# EasyEDA Pro project ProPrj_ESP32C3CameraTrigger 2026-09-02_2026-09-03.epro

# Schematic ESP32CamTrigger
Board Name: ESP32CamTrigger_1; Create Date: 2025-09-15; Page Name: ESP32CamTrigger_sch; Project Name: ESP32C3CameraTrigger 2025-09-15; Schematic Name: ESP32CamTrigger_1; Update Date: 2025-09-15; Company: www.jeefun.cc; Drawn: yiming@jeefun.cc; Page Size: A3; Part Number: JFPCB-2507-002; Reviewed: yiming@jeefun.cc; Version: V0.1
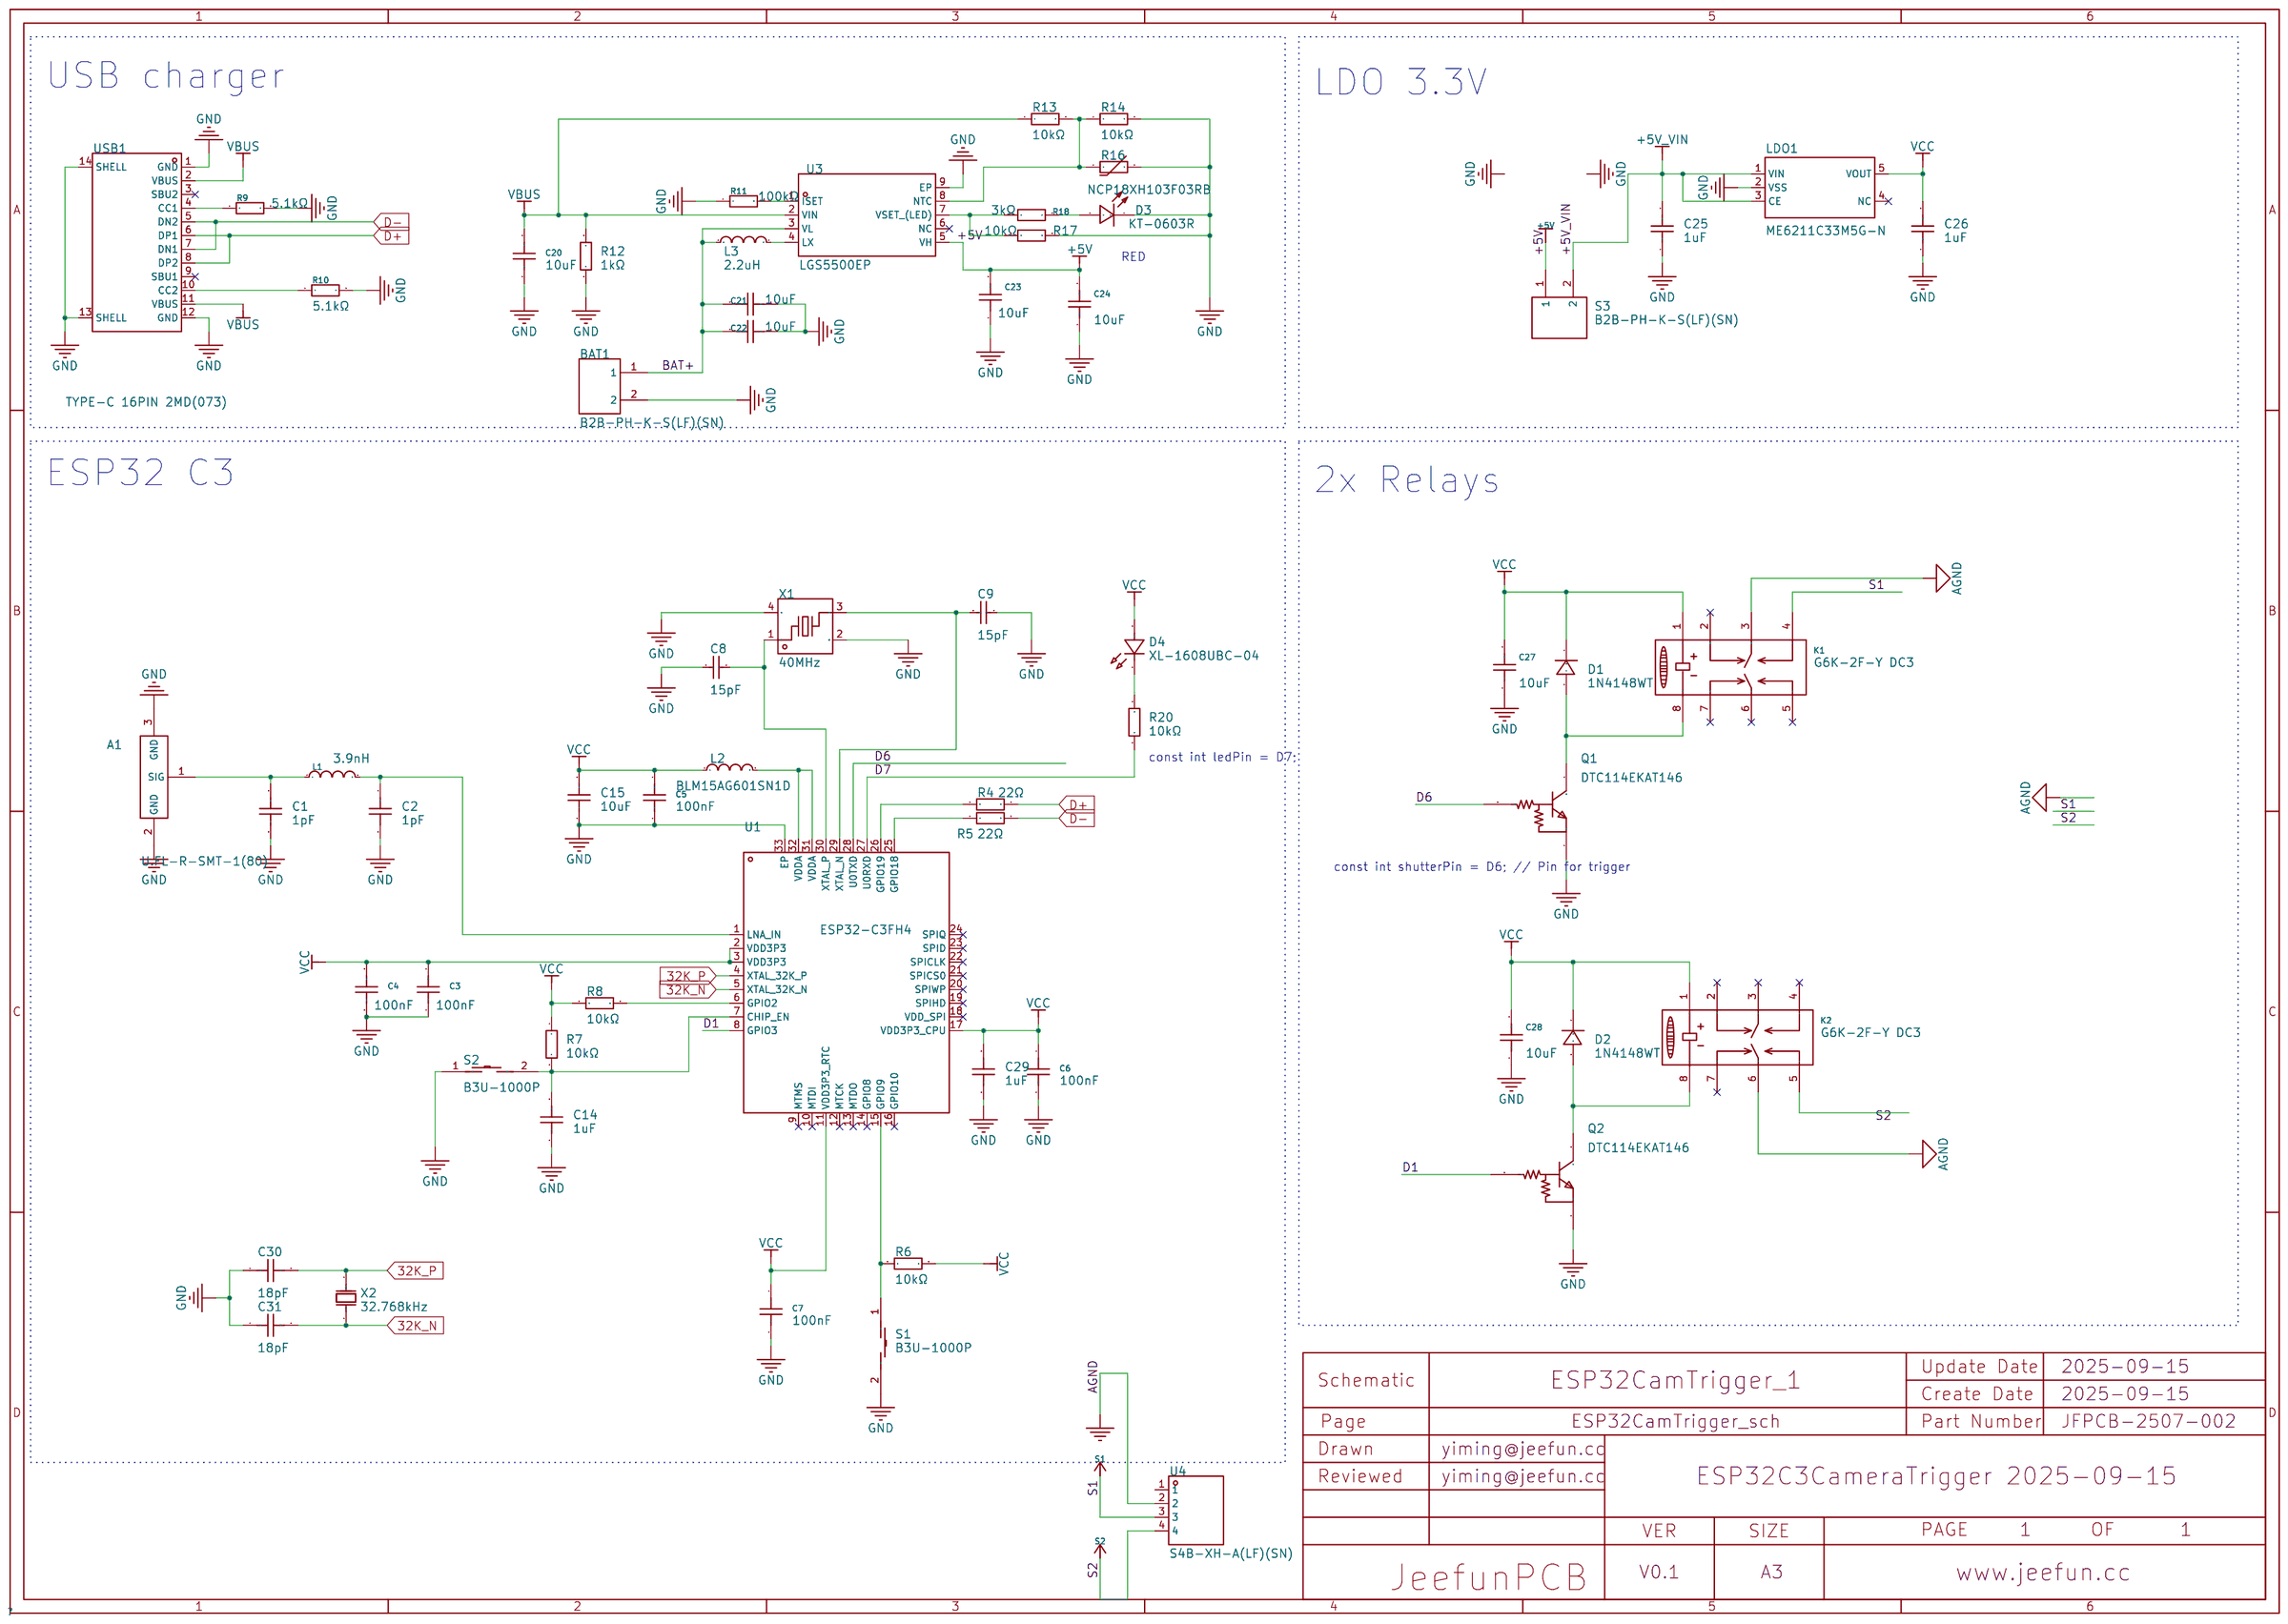
[diagram p0: schematic sheet]

## Parts
A1  U.FL-R-SMT-1(80)  [RF-SMD_FRF05002-JSS103M]
BAT1  B2B-PH-K-S(LF)(SN)  [CONN-TH_B2B-PH-K-S]
C1  1pF  [C0402]
C2  1pF  [C0402]
C3  100nF  [C0402]
C4  100nF  [C0402]
C5  100nF  [C0402]
C6  100nF  [C0402]
C7  100nF  [C0402]
C8  15pF  [C0402]
C9  15pF  [C0402]
C14  1uF  [C0603]
C15  10uF  [C0603]
C20  10uF  [C0603]
C21  10uF  [C0603]
C22  10uF  [C0603]
C23  10uF  [C0603]
C24  10uF  [C0603]
C25  1uF  [C0603]
C26  1uF  [C0603]
C27  10uF  [C0603]
C28  10uF  [C0603]
C29  1uF  [C0603]
C30  18pF  [C0402]
C31  18pF  [C0402]
D1  1N4148WT  [SOD-523_L1.2-W0.8-LS1.6-RD]
D2  1N4148WT  [SOD-523_L1.2-W0.8-LS1.6-RD]
D3  KT-0603R  [LED0603-RD]
D4  XL-1608UBC-04  [LED0603-RD_BLUE]
K1  G6K-2F-Y DC3  [RELAY-SMD_G6K-2F-Y]
K2  G6K-2F-Y DC3  [RELAY-SMD_G6K-2F-Y]
L1  3.9nH  [L0402]
L2  BLM15AG601SN1D  [L0402]
L3  2.2uH  [IND-SMD_L7.1-W6.5-P5.60]
LDO1  ME6211C33M5G-N  [SOT-23-5_L3.0-W1.7-P0.95-LS2.8-BL]
Q1  DTC114EKAT146  [SOT-346_L2.9-W1.6-P1.90-LS2.8-TR-CW]
Q2  DTC114EKAT146  [SOT-346_L2.9-W1.6-P1.90-LS2.8-TR-CW]
R4  22Ω  [R0402]
R5  22Ω  [R0402]
R6  10kΩ  [R0402]
R7  10kΩ  [R0402]
R8  10kΩ  [R0402]
R9  5.1kΩ  [R0402]
R10  5.1kΩ  [R0402]
R11  100kΩ  [R0402]
R12  1kΩ  [R0603]
R13  10kΩ  [R0402]
R14  10kΩ  [R0402]
R16  NCP18XH103F03RB  [R0603]
R17  10kΩ  [R0402]
R18  3kΩ  [R0402]
R20  10kΩ  [R0402]
S1  B3U-1000P  [KEY-SMD_B3U-1000PM]
S2  B3U-1000P  [KEY-SMD_B3U-1000PM]
S3  B2B-PH-K-S(LF)(SN)  [CONN-TH_B2B-PH-K-S]
U1  ESP32-C3FH4  [QFN-32_L5.0-W5.0-P0.50-BL-EP3.7]
U3  LGS5500EP  [ESOP-8_L4.9-W3.9-P1.27-LS6.0-TL-EP3.3]
U4  S4B-XH-A(LF)(SN)  [CONN-TH_S4B-XH-A-LF-SN]
USB1  TYPE-C 16PIN 2MD(073)  [USB-C-SMD_TYPE-C-6PIN-2MD-073]
X1  40MHz  [CRYSTAL-SMD_4P-L2.0-W1.6-BL-2]
X2  32.768kHz  [CRYSTAL-SMD_L3.2-W1.5-1]

## Library data of the parts
A1 = U.FL-R-SMT-1(80)_C88374: Connector Type:板端 Interface Type:内针 Number of Ports:1 Interface Diameter:2mm Interface Length/Height:1.25mm Frequency-Max:6GHz RF Series:IPEX Impedance:50Ω Style:- Contact Material:Brass Operating Temperature Range:-40℃~+90℃ Operating Temperature Range:-4; LCSC Part Name: IPEX 内针; Supplier Part: C88374; Manufacturer: HRS(广濑); Supplier Footprint: SMD; JLCPCB Part Class: Extended Part; Datasheet: https://atta.szlcsc.com/upload/public/pdf/source/20161125/1480067868647.pdf; Supplier: LCSC; Connector Type: 板端; Interface Type: 内针; Number of Ports: 1; Interface Diameter: 2mm; Interface Length/Height: 1.25mm; Frequency-Max: 6GHz; RF Series: IPEX; Impedance: 50Ω; Contact Material: Brass; Operating Temperature Range: -40℃~+90℃
BAT1 S3 = B2B-PH-K-S(LF)(SN): Pins Structure:1x2P Pitch:2mm Mounting Type:Direct Insert Reference Series:PH Number of Pins:2P Number of Rows:1 Number of PINs Per Row:2 Row Spacing:- Current Rating:2A Contact Material:Brass Contact Plating:Tin Operating Temperature:-25℃~+85℃ Operating; LCSC Part Name: 1x2P 间距:2mm 直插 系列:PH; Supplier Part: C131337; Manufacturer: JST; Supplier Footprint: 插件,P=2mm; JLCPCB Part Class: Extended Part; Datasheet: https://atta.szlcsc.com/upload/public/pdf/source/20171026/C131342_15089839687311058815.pdf; Supplier: LCSC; Pins Structure: 1x2P; Pitch: 2mm; Mounting Type: Direct Insert; Reference Series: PH; Number of Pins: 2P; Number of Rows: 1; Number of PINs Per Row: 2; Current Rating: 2A; Contact Material: Brass; Contact Plating: Tin; Operating Temperature: -25℃~+85℃; Voltage Rating: 100V; Plastic Material: PA66; Flame Retardant Rating: UL94V-0; Supplementary Features: K-leg punch; Color: White; Z-Height of the Board: 6mm; X-Length of Bottom Edge on Board (Spacing Line): 5.9mm; Y-Width of Bottom Edge on Board: 4.5mm
C1 C2 = CC0402CRNPO9BN1R0: Capacitance: Voltage Rated: Temperature Coefficient:; LCSC Part Name: 1pF 50V; Supplier Part: C277493; Manufacturer: YAGEO(国巨); Supplier Footprint: 0402; JLCPCB Part Class: Extended Part; Datasheet: https://atta.szlcsc.com/upload/public/pdf/source/20181008/C309499_21CC21451B82C39E3D92150FD6B30293.pdf; Supplier: LCSC
C3-C7 = GRM155R71H104KE14D: Capacitance: Tolerance:±10% Tolerance:±10% Voltage Rated: Temperature Coefficient:; LCSC Part Name: 100nF ±10% 50V; Supplier Part: C77020; Manufacturer: muRata(村田); Supplier Footprint: 0402; JLCPCB Part Class: Extended Part; Datasheet: https://atta.szlcsc.com/upload/public/pdf/source/20180326/C77020_39BD49C951FF1AF0DB1F1FAC5AC1E401.pdf; Supplier: LCSC; Tolerance: ±10%
C8 C9 = GJM1555C1H150FB01D: Capacitance: Tolerance:±1% Tolerance:±1% Voltage Rated: Temperature Coefficient:; LCSC Part Name: 15pF ±1% 50V; Supplier Part: C441742; Manufacturer: muRata(村田); Supplier Footprint: 0402; Datasheet: https://atta.szlcsc.com/upload/public/pdf/source/20200305/C490387_23319AE8C154DEB24C505E6C82A8106A.pdf; Supplier: LCSC; Tolerance: ±1%
C14 C25 C26 C29 = CGA0603X5R105K500JT: 容值:1uF;精度:±10%;额定电压:50V;温度系数:X5R;; LCSC Part Name: 1uF ±10% 50V; Supplier Part: C6119852; Manufacturer: HRE(芯声); Supplier Footprint: 0603; JLCPCB Part Class: 扩展库; Supplier: LCSC; Tolerance: ±10%; Voltage Rating: 50V; Temperature Coefficient: X5R
C15 C20-C24 C27 C28 = CL10A106MA8NRNC: Capacitance:10uF Tolerance:±20% Tolerance:±20% Voltage Rating:25V Temperature Coefficient:X5R; LCSC Part Name: 10uF ±20% 25V; Supplier Part: C96446; Manufacturer: SAMSUNG(三星); Supplier Footprint: 0603; JLCPCB Part Class: Basic Part; Datasheet: https://item.szlcsc.com/datasheet/CL10A106MA8NRNC/97651.html; Supplier: LCSC; Tolerance: ±20%; Voltage Rating: 25V; Temperature Coefficient: X5R
C30 C31 = GRM1555C1H180FA01D: Capacitance: Tolerance:±1% Tolerance:±1% Voltage Rated: Temperature Coefficient:; LCSC Part Name: 18pF ±1% 50V; Supplier Part: C161534; Manufacturer: muRata(村田); Supplier Footprint: 0402; JLCPCB Part Class: Extended Part; Datasheet: https://atta.szlcsc.com/upload/public/pdf/source/20180308/C161534_15204897149751413943.pdf; Supplier: LCSC; Tolerance: ±1%
D1 D2 = 1N4148WT_C232841: Diode Configuration:Independent Voltage - Forward(Vf@If):1V@10mA Voltage - DC Reverse(Vr):75V Current - Rectified:300mA Pd - Power Dissipation:200mW Reverse Leakage Current (Ir):5uA@75V Reverse Recovery Time (trr):4ns Operating Junction Temperature Range:; Supplier Part: C232841; Manufacturer: onsemi(安森美); Supplier Footprint: SOD-523F; JLCPCB Part Class: Extended Part; Datasheet: https://item.szlcsc.com/datasheet/1N4148WT/232639.html; Supplier: LCSC; Diode Configuration: Independent; Voltage - Forward(Vf@If): 1V@10mA; Voltage - DC Reverse(Vr): 75V; Current - Rectified: 300mA; Pd - Power Dissipation: 200mW; Reverse Leakage Current (Ir): 5uA@75V; Reverse Recovery Time (trr): 4ns; Operating Junction Temperature Range: -55℃~+150℃@(Tj)
D3 = KT-0603R: Emitted Color:Red Power Dissipation:- Forward Current:- Dominant Wavelength:- Dominant Wavelength:- Peak Wavelength:- Diode Configuration:- Lens Color:- Color Temperature:- Color Temperature:- Viewing Angle:- Mounting Sytle:- Operating Temperature:-40℃~+8; LCSC Part Name: 0603 红灯 高亮; Supplier Part: C2286; Manufacturer: KENTO; Supplier Footprint: 0603; JLCPCB Part Class: Basic Part; Datasheet: https://atta.szlcsc.com/upload/public/pdf/source/20160616/1466072038404.pdf; Supplier: LCSC; Emitted Color: Red; Operating Temperature: -40℃~+85℃
D4 = XL-1608UBC-04: Lamp Holder Type:- Illumination Color:Blue Voltage - Forward(Vf):3.3V Voltage - Forward(Vf):3.3V Power(Watts):70mW Forward Current:20mA Wavelength - Dominant:455nm~475nm Wavelength - Dominant:455nm~475nm Peak Wavelength:470nm Diode Configuration:- Lens Co; Supplier Part: C965807; Manufacturer: XINGLIGHT(成兴光); Supplier Footprint: 0603; JLCPCB Part Class: Extended Part; Datasheet: https://item.szlcsc.com/datasheet/XL-1608UBC-04/1051416.html; Supplier: LCSC; Illumination Color: Blue; Voltage - Forward(Vf): 3.3V; Power(Watts): 70mW; Forward Current: 20mA; Wavelength - Dominant: 455nm~475nm; Peak Wavelength: 470nm; Lens Color: Water Clear; Luminous Intensity: 300mcd; Viewing Angle: 120°; Mounting Style: op View Mount
K1 K2 = G6K-2F-Y DC3: Coil Voltage:- Contact Form:- Pin Number:- Contact Rating:- Maximum Switching Voltage:- Contact Material:- Coil Resistance:- Maximum Switching Current:- Operate Time:- Release Time:- Coil Type:- Contact Resistance:- Operating Temperature:- Operating Tempe; LCSC Part Name: G6K-2F-Y 3VDC; Supplier Part: C93168; Manufacturer: OMRON(欧姆龙); Supplier Footprint: SMD,6.5x10mm; JLCPCB Part Class: Extended Part; Datasheet: https://atta.szlcsc.com/upload/public/pdf/source/20220125/C1876770_53E5491D4B68F29C4BBD8118E9BAE0E8.pdf; Supplier: LCSC
L1 = LQG15HS3N9S02D: Inductance: Tolerance:- Tolerance:- Rated Current: Saturation Current (Isat):- DC Resistance (DCR): Q @ Freq:8@100MHz Frequency - Self Resonant: Ratings:; Supplier Part: C77109; Manufacturer: muRata(村田); Supplier Footprint: 0402; Datasheet: https://atta.szlcsc.com/upload/public/pdf/source/20180612/C185484_14F678484DDF036353DC67B6265A9221.pdf; Supplier: LCSC; Q @ Freq: 8@100MHz
L2 = BLM15AG601SN1D: Impedance @ Frequency:600Ω@100MHz Tolerance:±25% Tolerance:±25% DC Resistance:520mΩ Current Rating:300mA Circuits:1; LCSC Part Name: 单路 0402磁珠 阻抗600Ω@100MHz; Supplier Part: C76884; Manufacturer: muRata(村田); Supplier Footprint: 0402; JLCPCB Part Class: Extended Part; Datasheet: https://atta.szlcsc.com/upload/public/pdf/source/20181120/C333978_3E581FB55966932B05020139ABDE8E01.pdf; Supplier: LCSC; Impedance @ Frequency: 600Ω@100MHz; Tolerance: ±25%; DC Resistance: 520mΩ; Current Rating: 300mA; Circuits: 1
L3 = SPM6530T-2R2M: Inductance: Tolerance:±20% Tolerance:±20% Rated Current: Saturation Current (Isat):8.4A DC Resistance (DCR): Type:- Ratings:-; LCSC Part Name: 2.2uH ±20% 8.4A; Supplier Part: C76855; Manufacturer: TDK; Supplier Footprint: SMD,7.1x6.5mm; JLCPCB Part Class: Extended Part; Datasheet: https://atta.szlcsc.com/upload/public/pdf/source/20160918/1474166942087.pdf; Supplier: LCSC; Tolerance: ±20%; Saturation Current (Isat): 8.4A
LDO1 = ME6211C33M5G-N: Output Type:Fixed Voltage - Supply:6V Output Voltage:3.3V Output Voltage:3.3V Output Current:500mA Power Supply Rejection Ratio (PSRR):70dB@(1kHz) Voltage Dropout:120mV@(100mA) standby current:60uA Noise:50uVrms Features:Over Current Protection；Enable；Sho; LCSC Part Name: 输入6V 输出3.3V 500mA; Supplier Part: C82942; Manufacturer: MICRONE(南京微盟); Supplier Footprint: SOT-23-5; JLCPCB Part Class: Extended Part; Datasheet: https://atta.szlcsc.com/upload/public/pdf/source/20170918/C82942_1505727073070976520.pdf; Supplier: LCSC; Output Type: Fixed; Voltage - Supply: 6V; Output Voltage: 3.3V; Output Current: 500mA; Power Supply Rejection Ratio (PSRR): 70dB@(1kHz); Voltage Dropout: 120mV@(100mA); standby current: 60uA; Noise: 50uVrms; Features: Over Current Protection；Enable；Short Circuit Protection; Operating Temperature: -40℃~+150℃; Output Configuration: Positive; Number of Outputs: 1
Q1 Q2 = DTC114EKAT146: Transistor Type:- Collector-Emitter Breakdown Voltage (Vceo):50V Collector Current (Ic):50mA Power Dissipation (Pd):200mW DC Current Gain (hFE@Ic,Vce):30@5mA,5V; LCSC Part Name: 耐压:50V 电流:50mA; Supplier Part: C79971; Manufacturer: ROHM(罗姆); Supplier Footprint: TO-236-3(SOT-23-3); JLCPCB Part Class: Extended Part; Datasheet: https://atta.szlcsc.com/upload/public/pdf/source/20170818/C79971_1503051322827895391.pdf; Supplier: LCSC; Collector-Emitter Breakdown Voltage (Vceo): 50V; Collector Current (Ic): 50mA; Power Dissipation (Pd): 200mW; DC Current Gain (hFE@Ic,Vce): 30@5mA,5V
R4 R5 = RC0402JR-0722RL: Type:Thick Film Resistors Resistance: Tolerance:±5% Tolerance:±5% Power(Watts): Overload Voltage (Max): Temperature Coefficient:±100ppm/℃ Temperature Coefficient:±100ppm/℃ Operating Temperature Range:-55℃~+155℃ Operating Temperature Range:-55℃~+155℃; LCSC Part Name: 厚膜电阻 22Ω ±5% 62.5mW; Supplier Part: C93929; Manufacturer: YAGEO(国巨); Supplier Footprint: 0402; JLCPCB Part Class: Extended Part; Datasheet: https://atta.szlcsc.com/upload/public/pdf/source/20180821/C275644_0D56F95EFF785E7D9A1FEF436B37DA78.pdf; Supplier: LCSC; Type: Thick Film Resistors; Tolerance: ±5%; Temperature Coefficient: ±100ppm/℃; Operating Temperature Range: -55℃~+155℃
R6-R8 R13 R14 R17 R20 = RC0402FR-0710KL: Type:Thick Film Resistors Resistance: Tolerance:±1% Tolerance:±1% Power(Watts): Overload Voltage (Max): Temperature Coefficient:±100ppm/℃ Temperature Coefficient:±100ppm/℃ Operating Temperature Range:-55℃~+155℃ Operating Temperature Range:-55℃~+155℃; LCSC Part Name: 厚膜电阻 10kΩ ±1% 62.5mW; Supplier Part: C60490; Manufacturer: YAGEO(国巨); Supplier Footprint: 0402; Datasheet: https://atta.szlcsc.com/upload/public/pdf/source/20170925/C131467_1506321478108990263.pdf; Supplier: LCSC; Type: Thick Film Resistors; Tolerance: ±1%; Temperature Coefficient: ±100ppm/℃; Operating Temperature Range: -55℃~+155℃
R9 R10 = 0402WGF5101TCE: Type:Thick Film Resistor Resistance:5.1kΩ Tolerance:±1% Tolerance:±1% Power(Watts):62.5mW Voltage-Supply(Max):50V Temperature Coefficient:±100ppm/℃ Temperature Coefficient:±100ppm/℃ Operating Temperature:-55℃~+155℃ Operating Temperature:-55℃~+155℃; LCSC Part Name: 5.1kΩ ±1% 62.5mW 厚膜电阻; Supplier Part: C25905; Manufacturer: UNI-ROYAL(厚声); Supplier Footprint: 0402; JLCPCB Part Class: 基础库; Datasheet: https://item.szlcsc.com/datasheet/0402WGF5101TCE/26648.html; Supplier: LCSC; Type: Thick Film Resistor; Tolerance: ±1%; Power(Watts): 62.5mW; Voltage-Supply(Max): 50V; Temperature Coefficient: ±100ppm/℃; Operating Temperature: -55℃~+155℃
R11 = 0402WGF1003TCE: Type:Thick Film Resistor Resistance:100kΩ Tolerance:±1% Tolerance:±1% Power(Watts):62.5mW Voltage-Supply(Max):50V Temperature Coefficient:±100ppm/℃ Temperature Coefficient:±100ppm/℃ Operating Temperature:-55℃~+155℃ Operating Temperature:-55℃~+155℃; LCSC Part Name: 100kΩ ±1% 62.5mW 厚膜电阻; Supplier Part: C25741; Manufacturer: UNI-ROYAL(厚声); Supplier Footprint: 0402; JLCPCB Part Class: 基础库; Datasheet: https://item.szlcsc.com/datasheet/0402WGF1003TCE/26484.html; Supplier: LCSC; Type: Thick Film Resistor; Tolerance: ±1%; Power(Watts): 62.5mW; Voltage-Supply(Max): 50V; Temperature Coefficient: ±100ppm/℃; Operating Temperature: -55℃~+155℃
R12 = 0603WAJ0102T5E: Type:Thick Film Resistor Resistance:1kΩ Tolerance:±5% Tolerance:±5% Power(Watts):100mW Voltage-Supply(Max):75V Temperature Coefficient:±100ppm/℃ Temperature Coefficient:±100ppm/℃ Operating Temperature:-55℃~+155℃ Operating Temperature:-55℃~+155℃; LCSC Part Name: 1kΩ ±5% 100mW 厚膜电阻; Supplier Part: C25585; Manufacturer: UNI-ROYAL(厚声); Supplier Footprint: 0603; JLCPCB Part Class: 扩展库; Datasheet: https://item.szlcsc.com/datasheet/0603WAJ0102T5E/26328.html; Supplier: LCSC; Type: Thick Film Resistor; Tolerance: ±5%; Power(Watts): 100mW; Voltage-Supply(Max): 75V; Temperature Coefficient: ±100ppm/℃; Operating Temperature: -55℃~+155℃
R16 = NCP18XH103F03RB: Resistance @ 25℃:10kΩ B Constant (25℃/50℃):3380K B Constant (25℃/75℃):- B Constant (25℃/85℃):3434K B Constant (25℃/100℃):3455K Power(Watts):100mW B Constant Tolerance:±1% Steady State Current (Max):310uA Operating Temperature:-40℃~+125℃ Operating Temperat; Supplier Part: C13564; Manufacturer: muRata(村田); Supplier Footprint: 0603; JLCPCB Part Class: Extended Part; Datasheet: https://item.szlcsc.com/datasheet/NCP18XH103F03RB/14214.html; Supplier: LCSC; Resistance @ 25℃: 10kΩ; B Constant (25℃/50℃): 3380K; B Constant (25℃/85℃): 3434K; B Constant (25℃/100℃): 3455K; Power(Watts): 100mW; B Constant Tolerance: ±1%; Steady State Current (Max): 310uA; Operating Temperature: -40℃~+125℃
R18 = 0402WGF3001TCE: Type:Thick Film Resistors Resistance:3kΩ Tolerance:±1% Tolerance:±1% Power(Watts): Overload Voltage (Max): Temperature Coefficient:±100ppm/℃ Temperature Coefficient:±100ppm/℃ Operating Temperature Range:-55℃~+155℃ Operating Temperature Range:-55℃~+155℃; LCSC Part Name: 3kΩ ±1% 62.5mW 厚膜电阻; Supplier Part: C25784; Manufacturer: UNI-ROYAL(厚声); Supplier Footprint: 0402; JLCPCB Part Class: Extended Part; Datasheet: https://atta.szlcsc.com/upload/public/pdf/source/20200306/C422600_1E6D84923E4A46A82E41ADD87F860B5C.pdf; Supplier: LCSC; Type: Thick Film Resistors; Tolerance: ±1%; Temperature Coefficient: ±100ppm/℃; Operating Temperature Range: -55℃~+155℃
S1 S2 = B3U-1000P_C231329: Circuit:SPST Actuator Style:Round Button Operating Force:153gf Mounting Style:Standing paste Switch Length:3mm Switch Width:2.5mm Switch Height:1.6mm Contact Current:50mA Voltage Rating (DC):12V With Lamp:- Pin Style:SMDSplicing Mechanical Life:- Operatin; LCSC Part Name: 3*2.5*1.6mm 立贴 轻触开关; Supplier Part: C231329; Manufacturer: OMRON(欧姆龙); Supplier Footprint: SMD,2.5x3mm; JLCPCB Part Class: Extended Part; Supplier: LCSC; Circuit: SPST; Actuator Style: Round Button; Operating Force: 153gf; Mounting Style: Standing paste; Switch Length: 3mm; Switch Width: 2.5mm; Switch Height: 1.6mm; Contact Current: 50mA; Voltage Rating (DC): 12V; Pin Style: SMDSplicing; Operating Temperature: -25℃~+70℃
U1 = ESP32-C3FH4: Supplier Part: C2858491; Manufacturer: ESPRESSIF(乐鑫); Supplier Footprint: QFN-32-EP(5x5); JLCPCB Part Class: Extended Part; Datasheet: https://item.szlcsc.com/datasheet/ESP32-C3FH4/3060870.html; Supplier: LCSC
U3 = LGS5500EP: The Chip Type:Battery Charge and Discharge Management Supply Voltage:4.5V~5.5V Supply Voltage:4.5V~5.5V Maximum Charge Current:1A Charging Saturation Voltage:4.6V；4.35V；4.3V；4.2V End-Off Voltage:2.9V Type of Battery:Lithium-ion/Polymer Number of Cells:1 N; LCSC Part Name: 1A充电,0.3A同步升压放电,超低待机2uA+的TP5400,ETA9697; Supplier Part: C5280699; Manufacturer: Legend-Si(棱晶半导体); Supplier Footprint: ESOP-8; JLCPCB Part Class: Extended Part; Datasheet: https://atta.szlcsc.com/upload/public/pdf/source/20230407/FCD039C21EAAD2C20B987E5BAB1B60C9.pdf; Supplier: LCSC; The Chip Type: Battery Charge and Discharge Management; Supply Voltage: 4.5V~5.5V; Maximum Charge Current: 1A; Charging Saturation Voltage: 4.6V；4.35V；4.3V；4.2V; End-Off Voltage: 2.9V; Type of Battery: Lithium-ion/Polymer; Number of Cells: 1; Operating Temperature: -40℃~+125℃
U4 = S4B-XH-A(LF)(SN): Pins Structure:1x4P Pitch:2.5mm Mounting Type:Right Angle Reference Series:XH Number of Pins:4P Number of Rows:1 Number of PINs Per Row:4 Row Spacing:- Current Rating:3A Contact Material:Brass Contact Plating:Tin Operating Temperature:-25℃~+85℃ Operating; LCSC Part Name: 1x4P 间距:2.5mm 弯插 系列:XH; Supplier Part: C157925; Manufacturer: JST; Supplier Footprint: 弯插,P=2.5mm; JLCPCB Part Class: Extended Part; Datasheet: https://item.szlcsc.com/datasheet/S4B-XH-A(LF)(SN)/169273.html; Supplier: LCSC; Pins Structure: 1x4P; Pitch: 2.5mm; Mounting Type: Right Angle; Reference Series: XH; Number of Pins: 4P; Number of Rows: 1; Number of PINs Per Row: 4; Current Rating: 3A; Contact Material: Brass; Contact Plating: Tin; Operating Temperature: -25℃~+85℃; Voltage Rating: 250V; Plastic Material: PA66; Flame Retardant Rating: UL94V-0; Supplementary Features: K Pin; Color: White; Z-Height of the Board: 6.1mm; X-Length of Bottom Edge on Board (Spacing Line): 12.4mm; Y-Width of Bottom Edge on Board: 11.5mm
USB1 = TYPE-C 16PIN 2MD(073): Connector Type:Type-C Protocol Standard:USB 3.1 Gender:Female Mounting Type:Surface Mount, Right Angle Number of Contacts:16P Number of Ports:1 Current Rating-Power:3A Voltage Rating:5V Connect-Disconnect Life:5,000 Cycles Supplementary Features:- Center; LCSC Part Name: Type-C 母 卧贴; Supplier Part: C2765186; Manufacturer: SHOU HAN(首韩); Supplier Footprint: SMD; JLCPCB Part Class: Extended Part; Datasheet: https://item.szlcsc.com/datasheet/TYPE-C%252016PIN%25202MD(073)/2901843.html; Supplier: LCSC; Connector Type: Type-C; Protocol Standard: USB 3.1; Gender: Female; Mounting Type: Surface Mount, Right Angle; Number of Contacts: 16P; Number of Ports: 1; Current Rating-Power: 3A; Voltage Rating: 5V; Connect-Disconnect Life: 5,000 Cycles; Detection color: Black; Operating Temperature: -25℃~+85℃
X1 = T201640MFBDE2X: Frequency:40MHz Normal temperature Frequency Tolerance:±10ppm Normal temperature Frequency Tolerance:±10ppm Load Capacitance: Operating Temperature: Operating Temperature:; LCSC Part Name: 40MHz ±10ppm 12pF; Supplier Part: C20885029; Manufacturer: YJX(雅晶鑫); Supplier Footprint: SMD2016-4P; JLCPCB Part Class: 扩展库; Datasheet: https://atta.szlcsc.com/upload/public/pdf/source/20240301/69B1A2250A2F911AB14AAD6A982488C4.pdf; Supplier: LCSC; Normal temperature Frequency Tolerance: ±10ppm
X2 = XKXGI-SUA-32.768K: Type:Surface Mount Crystal Frequency:32.768kHz Normal temperature Frequency Tolerance:±20ppm Normal temperature Frequency Tolerance:±20ppm Load Capacitance:12.5pF Frequency Stability:±30ppm Frequency Stability:±30ppm Operating Temperature:-40℃~+85℃ Operat; LCSC Part Name: YST310S 32.768KHZ 2P 3215 12.5PF ±20PPM -40~85℃; Supplier Part: C5213671; Manufacturer: YXC(扬兴晶振); Supplier Footprint: SMD3215-2P; JLCPCB Part Class: Extended Part; Datasheet: https://item.szlcsc.com/datasheet/XKXGI-SUA-32.768K/5908943.html; Supplier: LCSC; Type: Surface Mount Crystal; Normal temperature Frequency Tolerance: ±20ppm; Load Capacitance: 12.5pF; Frequency Stability: ±30ppm; Operating Temperature: -40℃~+85℃

## Nets
+5V: C23.2 C24.2 S3.1 U3.5(VH)
+5V_VIN: C25.2 LDO1.1(VIN) LDO1.3(CE) S3.2
AGND: K1.3 K2.6 U4.2
GND: A1.2(GND) A1.3(GND) BAT1.2 C1.2 C2.2 C3.1 C4.1 C5.2 C6.2 C7.2 C8.1 C9.2 C14.1 C15.1 C20.1 C21.1 C22.1 C23.1 C24.1 C25.1 C26.1 C27.1 C28.1 C29.1 C30.1 C31.1 D3.1(K) LDO1.2(VSS) Q1.1(E) Q2.1(E) R9.2 R10.2 R11.1 R12.1 R14.2 R16.2 R17.2 S1.2 S2.1 U1.33(EP) U3.9(EP) USB1.1(GND) USB1.12(GND) USB1.13(SHELL) USB1.14(SHELL) X1.2(GND) X1.4(GND)
VBUS: C20.2 R12.2 R13.1 U3.2(VIN) USB1.2(VBUS) USB1.11(VBUS)
VCC: C3.2 C4.2 C5.1 C6.1 C7.1 C15.2 C26.2 C27.2 C28.2 C29.2 D1.1(C) D2.1(C) D4.2(A) K1.1 K2.1 L2.1 LDO1.5(VOUT) R6.2 R7.1 R8.1 U1.2(VDD3P3) U1.3(VDD3P3) U1.11(VDD3P3_RTC) U1.17(VDD3P3_CPU)
32K_N: C31.2 U1.5(XTAL_32K_N) X2.1(OSC1)
32K_P: C30.2 U1.4(XTAL_32K_P) X2.2(OSC2)
BAT+: BAT1.1 C21.2 C22.2 L3.1 U3.3(VL)
D1: Q2.2(B) U1.8(GPIO3)
D6: Q1.2(B) U1.28(U0TXD)
D7: R20.1 U1.27(U0RXD)
D+: R4.2 USB1.6(DP1) USB1.8(DP2)
D-: R5.2 USB1.5(DN2) USB1.7(DN1)
S1: K1.4 U4.3
S2: K2.5 U4.4
$1N506: A1.1(SIG) C1.1 L1.1
$1N541: C2.1 L1.2 U1.1(LNA_IN)
$1N1807: C8.2 U1.30(XTAL_P) X1.1
$1N1815: C9.1 U1.29(XTAL_N) X1.3
$1N6331: R4.1 U1.26(GPIO19)
$1N6375: R5.1 U1.25(GPIO18)
$1N6429: C14.2 R7.2 S2.2 U1.7(CHIP_EN)
$1N6490: R6.1 S1.1 U1.15(GPIO9)
$1N9298: R8.2 U1.6(GPIO2)
$1N9448: L2.2 U1.31(VDDA) U1.32(VDDA)
$1N12514: R9.1 USB1.4(CC1)
$1N12518: R10.1 USB1.10(CC2)
$1N12731: R11.2 U3.1(ISET)
$1N13266: R13.2 R14.1 R16.1 U3.8(NTC)
$1N13419: L3.2 U3.4(LX)
$1N13736: R17.1 R18.1 U3.7(VSET (LED))
$1N13763: D3.2(A) R18.2
$1N14938: D1.2(A) K1.8 Q1.3(C)
$1N15274: D2.2(A) K2.8 Q2.3(C)
$1N15885: D4.1(K) R20.2

Not connected (* = marked no-connect by the designer): K1 2* 5* 6* 7*; K2 2* 3* 4* 7*; LDO1 4(NC)*; U1 9(MTMS)* 10(MTDI)* 12(MTCK)* 13(MTDO)* 14(GPIO8)* 16(GPIO10)* 18(VDD_SPI)* 19(SPIHD)* 20(SPIWP)* 21(SPICS0)* 22(SPICLK)* 23(SPID)* 24(SPIQ)*; U3 6(NC)*; U4 1; USB1 3(SBU2)* 9(SBU1)*

## Notes on the sheet
- USB charger
- LDO 3.3V
- RED
- ESP32 C3
- 2x Relays
- const int ledPin = D7;
- const int shutterPin = D6; // Pin for trigger

# Board ESP32CamTrigger_PCB
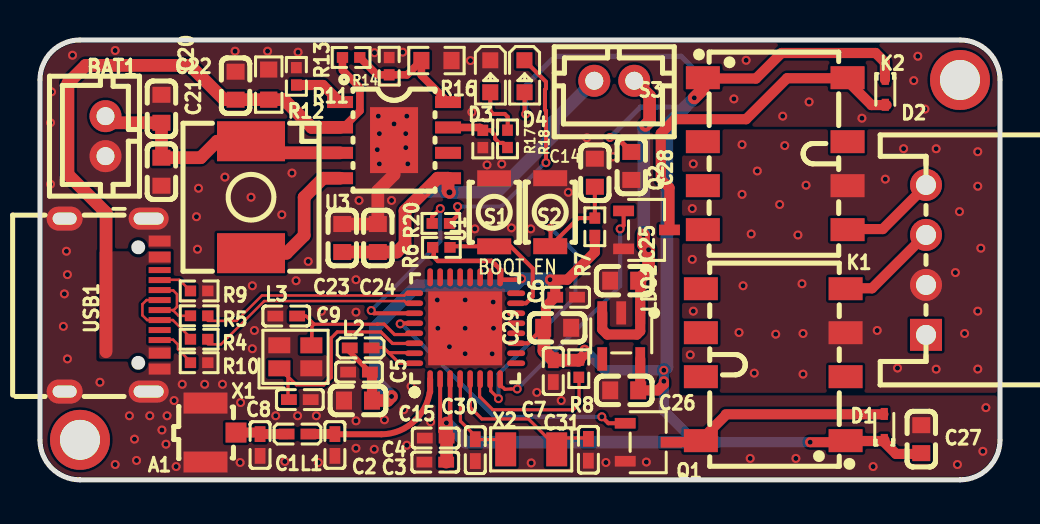
[diagram p1: board, top side]
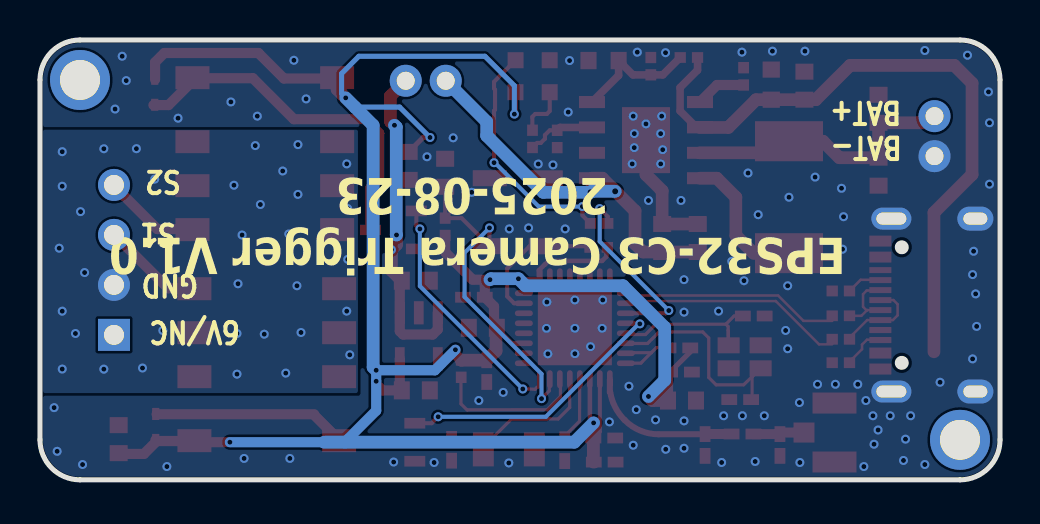
[diagram p2: board, bottom side, seen from below]

Outline 48 x 22 mm; copper layers: Top Layer, Bottom Layer. Coordinates in mm from the lower left corner of the outline.
Outline path: 0,20 0,2 arc(0.59,0.59) 2,0 46,0 arc(47.41,0.59) 48,2 48,20 arc(47.41,21.41) 46,22 2,22 arc(0.59,21.41) 0,20
Stack: Top Layer 0.035mm / Dielectric1 0.91mm FR4 er 4.5 / Bottom Layer 0.035mm

## Design rules (mm)
net D-: DP1
net D+: DP1
net $1N6375: DP2
net $1N6331: DP2
spacing copperThickness1oz (default): track to track 0.229, other pairs 0.152 to 0.3
spacing copperThickness2oz: track to track 0.203, other pairs 0.152 to 0.3
spacing Plane_innerPlane: track to track 0.229, other pairs 0.152 to 0.3
spacing Copper_copperRegion: track to track 0.229, other pairs 0.152 to 0.3
track width copperThickness1oz (default): min 0.127, default 0.16, max 2.54
track width copperThickness2oz: min 0.203, default 0.254, max 2.54
track width 3v: min 0.127, default 0.2, max 2.54
track width 5v: min 0.127, default 0.254, max 2.54
track width gnd: min 0.127, default 0.13, max 2.54
differential pair differentialPair (default): width min 0.127, default 0.254, max 2.54; gap min 0.152, default 0.152
net GND uses gnd
net +5V uses 5v
net VCC uses 3v
pour e516 uses Copper_copperRegion
pour e518 uses Copper_copperRegion
pour e520 uses Copper_copperRegion
pour e526 uses Copper_copperRegion
pour e528 uses Copper_copperRegion

## Placement (name value [footprint] x y rotation side)
A1  U.FL-R-SMT-1(80)  [RF-SMD_FRF05002-JSS103M]  9.04 2.37 90 top
BAT1  B2B-PH-K-S(LF)(SN)  [CONN-TH_B2B-PH-K-S]  3.28 17.19 90 top
C1  1pF  [C0402]  11 1.74 270 top
C2  1pF  [C0402]  14.74 1.74 270 top
C3  100nF  [C0402]  19.76 0.89 0 top
C4  100nF  [C0402]  19.78 2.09 0 top
C5  100nF  [C0402]  15.95 5.39 180 top
C6  100nF  [C0402]  26.31 9.13 0 top
C7  100nF  [C0402]  25.66 5.44 270 top
C8  15pF  [C0402]  12.99 4.01 180 top
C9  15pF  [C0402]  12.31 8.19 180 top
C14  1uF  [C0603]  27.74 15.36 270 top
C15  10uF  [C0603]  15.9 3.97 0 top
C20  10uF  [C0603]  9.78 19.71 270 top
C21  10uF  [C0603]  6.07 15.41 90 top
C22  10uF  [C0603]  6.07 18.56 270 top
C23  10uF  [C0603]  15.11 12.09 270 top
C24  10uF  [C0603]  16.89 12.09 270 top
C25  1uF  [C0603]  29.21 9.96 0 top
C26  1uF  [C0603]  29.21 4.47 0 top
C27  10uF  [C0603]  44.06 2.03 270 top
C28  10uF  [C0603]  29.57 15.7 90 top
C29  1uF  [C0603]  25.86 7.61 180 top
C30  18pF  [C0402]  21.76 1.48 90 top
C31  18pF  [C0402]  27.42 1.5 90 top
D1  1N4148WT  [SOD-523_L1.2-W0.8-LS1.6-RD]  42.22 2.64 90 top
D2  1N4148WT  [SOD-523_L1.2-W0.8-LS1.6-RD]  42.27 19.41 270 top
D3  KT-0603R  [LED0603-RD]  22.51 20.19 270 top
D4  XL-1608UBC-04  [LED0603-RD_BLUE]  24.22 20.19 270 top
K1  G6K-2F-Y DC3  [RELAY-SMD_G6K-2F-Y]  36.66 5.76 90 top
K2  G6K-2F-Y DC3  [RELAY-SMD_G6K-2F-Y]  36.76 16.31 270 top
L1  3.9nH  [L0402]  12.88 2.29 0 top
L2  BLM15AG601SN1D  [L0402]  16.03 6.6 0 top
L3  2.2uH  [IND-SMD_L7.1-W6.5-P5.60]  10.55 14.14 270 top
LDO1  ME6211C33M5G-N  [SOT-23-5_L3.0-W1.7-P0.95-LS2.8-BL]  29.06 7.2 180 top
NOREF  -  [Pad_e169]  2 2 0 top
NOREF#2  -  [Pad_e170]  46 20 0 top
Q1  DTC114EKAT146  [SOT-346_L2.9-W1.6-P1.90-LS2.8-TR-CW]  30.41 1.88 180 top
Q2  DTC114EKAT146  [SOT-346_L2.9-W1.6-P1.90-LS2.8-TR-CW]  30.33 12.5 180 top
R4  22Ω  [R0402]  7.96 7.03 180 top
R5  22Ω  [R0402]  7.96 8.2 180 top
R6  10kΩ  [R0402]  20.07 11.63 180 top
R7  10kΩ  [R0402]  27.74 12.66 90 top
R8  10kΩ  [R0402]  26.94 5.56 270 top
R9  5.1kΩ  [R0402]  7.96 9.45 0 top
R10  5.1kΩ  [R0402]  7.96 5.86 0 top
R11  100kΩ  [R0402]  12.82 20.18 270 top
R12  1kΩ  [R0603]  11.44 19.77 270 top
R13  10kΩ  [R0402]  15.56 21.13 0 top
R14  10kΩ  [R0402]  17.46 20.69 90 top
R16  NCP18XH103F03RB  [R0603]  19.82 20.97 0 top
R17  10kΩ  [R0402]  22.14 17.05 270 top
R18  3kΩ  [R0402]  23.38 17.05 90 top
R20  10kΩ  [R0402]  20.04 12.82 0 top
S1  B3U-1000P  [KEY-SMD_B3U-1000PM]  22.71 13.38 90 top
S2  B3U-1000P  [KEY-SMD_B3U-1000PM]  25.51 13.39 270 top
S3  B2B-PH-K-S(LF)(SN)  [CONN-TH_B2B-PH-K-S]  28.71 19.96 180 top
U1  ESP32-C3FH4  [QFN-32_L5.0-W5.0-P0.50-BL-EP3.7]  21.26 7.58 0 top
U3  LGS5500EP  [ESOP-8_L4.9-W3.9-P1.27-LS6.0-TL-EP3.3]  17.7 16.99 0 top
U4  S4B-XH-A(LF)(SN)  [CONN-TH_S4B-XH-A-LF-SN]  44.3 11 270 top
USB1  TYPE-C 16PIN 2MD(073)  [USB-C-SMD_TYPE-C-6PIN-2MD-073]  3.61 8.74 270 top
X1  40MHz  [CRYSTAL-SMD_4P-L2.0-W1.6-BL-2]  12.77 6.15 0 top
X2  32.768kHz  [CRYSTAL-SMD_L3.2-W1.5-1]  24.56 1.52 180 top

## Footprints (pads in the part's own frame, mm; a bottom-side part is the same pattern mirrored in y, then rotated)
C0402
  rect 0.79x0.54 smd: 1(-0.545,0) 2(0.545,0)
C0603
  rect 0.8x0.9 smd: 1(-0.7,0) 2(0.7,0)
CONN-TH_B2B-PH-K-S
  round 1.6 hole 0.9: 1(1,0) 2(-1,0)
CONN-TH_S4B-XH-A-LF-SN
  rect 1.6x1.6 hole 1: 1(3.75,0)
  round 1.6 hole 1: 2(1.25,0) 3(-1.25,0) 4(-3.75,0)
CRYSTAL-SMD_4P-L2.0-W1.6-BL-2
  rect 1.1x0.8 smd: 1(-0.8,-0.575) 2(0.8,-0.575) 3(0.8,0.575) 4(-0.8,0.575)
CRYSTAL-SMD_L3.2-W1.5-1
  rect 1.05x1.7 smd: 1(-1.275,0) 2(1.275,0)
ESOP-8_L4.9-W3.9-P1.27-LS6.0-TL-EP3.3
  rect 1.3x0.6 smd: 1(-2.7,1.905) 2(-2.7,0.635) 3(-2.7,-0.635) 4(-2.7,-1.905) 5(2.7,-1.905) 6(2.7,-0.635) 7(2.7,0.635) 8(2.7,1.905)
  rect 2.4x3.3 smd: 9(0,0)
IND-SMD_L7.1-W6.5-P5.60
  rect 2x3.4 smd: 1(-2.8,0) 2(2.8,0)
KEY-SMD_B3U-1000PM
  rect 0.8x1.7 smd: 1(-1.7,0) 2(1.7,0)
L0402
  rect 0.79x0.54 smd: 1(-0.545,0) 2(0.545,0)
LED0603-RD
  rect 0.8x0.8 smd: 1(-0.799,0) 2(0.799,0)
LED0603-RD_BLUE
  rect 0.8x0.8 smd: 1(-0.799,-0.004) 2(0.799,0.004)
Pad_e169
  round 3 hole 2: 1(0,0)
Pad_e170
  round 3 hole 2: 1(0,0)
QFN-32_L5.0-W5.0-P0.50-BL-EP3.7
  oval 0.28x0.9 smd: 1(-1.75,-2.55) 2(-1.25,-2.55) 3(-0.75,-2.55) 4(-0.25,-2.55) 5(0.25,-2.55) 6(0.75,-2.55) 7(1.25,-2.55) 8(1.75,-2.55) 17(1.75,2.55) 18(1.25,2.55) 19(0.75,2.55) 20(0.25,2.55) 21(-0.25,2.55) 22(-0.75,2.55) 23(-1.25,2.55) 24(-1.75,2.55)
  oval 0.9x0.28 smd: 9(2.55,-1.75) 10(2.55,-1.25) 11(2.55,-0.75) 12(2.55,-0.25) 13(2.55,0.25) 14(2.55,0.75) 15(2.55,1.25) 16(2.55,1.75) 25(-2.55,1.75) 26(-2.55,1.25) 27(-2.55,0.75) 28(-2.55,0.25) 29(-2.55,-0.25) 30(-2.55,-0.75) 31(-2.55,-1.25) 32(-2.55,-1.75)
  rect 3.7x3.7 smd: 33(0,0)
R0402
  rect 0.566x0.54 smd: 1(-0.433,0) 2(0.433,0)
R0603
  rect 0.806x0.864 smd: 1(-0.753,0) 2(0.753,0)
RELAY-SMD_G6K-2F-Y
  rect 1.15x1.7 smd: 1(-3.8,-3.618) 2(-0.6,-3.618) 3(1.6,-3.618) 4(3.8,-3.618) 5(3.8,3.618) 6(1.6,3.618) 7(-0.6,3.618) 8(-3.8,3.618)
RF-SMD_FRF05002-JSS103M
  rect 1x1.05 smd: 1(0,-0.762)
  rect 1.05x2.2 smd: 2(-1.475,0.762) 3(1.475,0.762)
SOD-523_L1.2-W0.8-LS1.6-RD
  rect 0.6x0.36 smd: 1(-0.65,0) 2(0.65,0)
SOT-23-5_L3.0-W1.7-P0.95-LS2.8-BL
  rect 0.49x1.157 smd: 1(-0.95,-1.153) 2(0,-1.153) 3(0.95,-1.153)
  rect 0.49x1.175 smd: 4(0.95,1.153) 5(-0.95,1.153)
SOT-346_L2.9-W1.6-P1.90-LS2.8-TR-CW
  rect 1.045x0.532 smd: 1(1.147,0.95) 2(1.147,-0.95) 3(-1.147,0)
USB-C-SMD_TYPE-C-6PIN-2MD-073
  rect 0.55x1.1 smd: 1(-3.2,2.375) 2(-2.4,2.375) 11(2.4,2.375) 12(3.2,2.375)
  rect 0.3x1.1 smd: 3(-1.75,2.375) 4(-1.25,2.375) 5(-0.75,2.375) 6(-0.25,2.375) 7(0.25,2.375) 8(0.75,2.375) 9(1.25,2.375) 10(1.75,2.375)
  oval 1.1x2 hole 0.6x1.5: 13(-4.325,1.825) 14(4.325,1.825)
  oval 1.2x1.8 hole 0.6x1.2: 13(-4.325,-2.375) 14(4.325,-2.375)

## Nets
As in the schematic.

Pads without a net: K1 2 5 6 7; K2 2 3 4 7; LDO1 4; NOREF 1; NOREF#2 1; U1 9 10 12 13 14 16 18 19 20 21 22 23 24; U3 6; U4 1; USB1 3 9

## Via types
v1: diameter 0.45, hole 0.25, Top Layer to Bottom Layer, 166 vias
v2: diameter 0.61, hole 0.305, Top Layer to Bottom Layer, 2 vias

## Routing (per net, layer and track width the routed paths; a pad name or vN(x,y) marks a point on that pad's centre or on a via; arc(x,y) is an arc through that point)
+5V: length 19.7
  Top Layer w0.635: v2(20.47,14.38) 20.4,14.45 U3.5 19.88,15.09 18.25,13.45 18.25,11.8 17.84,11.39 C24.2 C23.2
  Bottom Layer w0.635: v2(19.24,14.43) 20.42,14.43 v2(20.47,14.38) 22.83,14.38 25.67,17.21 25.67,17.91 S3.1
+5V_VIN: length 16.2
  Top Layer w0.508: LDO1.3 28.11,7.52 28.37,7.27 29.84,7.27 30.01,7.43 LDO1.1 30.01,9.96
  Top Layer w0.635: v1(30.18,12.25) 30.18,11.76 v1(30.43,11.51) 30.43,10.48 C25.2 ; S3.2 30.48,19.19 30.48,17.94 v1(30.28,17.73)
  Bottom Layer w0.635: v1(30.28,17.73) 30.19,17.64 30.19,12.26 v1(30.18,12.25)
AGND:
  vias: v1(32.51,6.25) v1(32.61,13.57) v1(32.61,11.03) v1(32.66,15.8) v1(32.66,8.44) v1(34.95,7.37) v1(35.1,16.77) v1(35.1,14.28) v1(35.15,9.71) v1(35.56,12.3) v1(35.71,5.34) v1(35.87,15.45) v1(36.79,7.28) v1(36.98,13.77) v1(37.24,16.72) v1(37.9,12.25) v1(38.1,9.81) v1(38.15,7.32) v1(38.15,5.29) v1(38.3,14.74) v1(41.86,7.47) v1(42.27,15.04) v1(42.88,5.59) v1(43.18,16.56) v1(44.81,16.56) v1(44.81,5.54) v1(45.77,10.37) v1(45.97,13.42) v1(46.23,7.32) v1(46.89,16.41) v1(46.89,14.69) v1(46.89,8.44) v1(46.89,5.54) v1(47.04,11.59)
GND: length 6.3
  Top Layer w0.635: C23.1 C24.1 16.89,14.46 17.7,15.27 U3.9
  vias: v1(0.53,17.86) v1(0.53,14.79) v1(0.58,19.4) v1(1.22,9.3) v1(1.17,7.67) v1(1.32,11.43) v1(1.37,10.27) v1(1.37,6.05) v1(1.63,21.24) v1(3,4.88) v1(3.76,21.47) v1(3.76,0.77) v1(4.47,3.2) v1(4.72,2.04) v1(4.83,0.97) v1(5.49,3.2) v1(6.1,2.49) v1(6.3,1.78) v1(6.35,3.2) v1(6.71,3.97) v1(6.81,0.66) v1(7.11,4.78) v1(7.82,13.16) v1(7.92,14.58) v1(7.87,11.53) v1(8.23,4.78) v1(9.12,4.78) v1(9.25,15.14) v1(9.75,21.44) v1(10.03,3.87) v1(10.01,0.87) v1(10.55,14.13) v1(10.62,9.71) v1(10.62,6.56) v1(10.72,7.47) v1(11.38,21.44) v1(11.79,3.2) v1(12.09,13.26) v1(12.24,0.92) v1(12.6,15.34) v1(12.8,9.96) v1(12.9,21.39) v1(12.88,3.2) v1(13.41,10.93) v1(13.82,3.2) v1(13.92,0.87) v1(14.07,8.44) v1(15.8,10.01) v1(15.8,8.39) v1(15.8,2.95) v1(15.8,1.58) v1(15.95,13.97) v1(16.72,21.36) v1(16.71,1.53) v1(16.92,18.19) v1(16.87,16.51) v1(16.97,17.32) v1(16.97,15.8) v1(17.22,3) v1(17.58,13.97) v1(17.7,17.8) v1(18.14,21.39) v1(18.19,3.51) v1(18.34,18.19) v1(18.28,17.32) v1(18.29,16.61) v1(18.34,1.73) v1(18.39,15.8) v1(18.55,4.68) v1(19.53,2.9) v1(19.86,9) v1(19.89,7.58) v1(20.47,6.66) v1(21.26,9) v1(21.26,7.58) v1(21.26,6.31) v1(21.52,20.97) v1(21.59,18.39) v1(21.74,12.55) v1(22.35,15.75) v1(22.61,6.3) v1(22.66,8.89) v1(22.68,7.58) v1(23.09,15.8) v1(23.57,12.6) v1(24.54,12.55) v1(24.56,0.84) v1(24.84,4.37) v1(26.06,3.97) v1(26.42,14.38) v1(27.34,17.11) v1(28.3,0.87) v1(28.65,16.16) v1(30.32,0.89) v1(34.7,19.05) v1(35.31,20.98) v1(35.51,1.07) v1(37.13,18.19) v1(37.79,1.07) v1(38.46,18.9) v1(41.1,18.09) v1(41.66,0.66) v1(43.69,19.97) v1(43.89,21.19) v1(44.25,18.55) v1(45.87,0.77) v1(47.14,1.43) v1(47.29,3.61)
VBUS: length 33.9
  Top Layer w0.381: U3.2 15.12,17.75 15.29,17.75 16,18.45 16,19.62 15.12,20.49 R13.1
  Top Layer w0.635: U3.2 13.59,17.63 12.2,19.01 R12.2 C20.2 9.21,19.01 7.49,20.73 2.29,20.73 1.4,19.84 1.4,15.27 3.3,13.36 3.3,6.4
VCC: length 124
  Top Layer w0.2: 20.01,5.1 20.01,2.41 C4.2
  Top Layer w0.203: D4.2 24.23,18.35 v1(24.28,18.29) ; C29.2 24.39,6.83 23.73,6.83
  Top Layer w0.229: 19.63,11.63 19.69,11.58 19.69,11.16 19.9,10.95 22.57,10.95 22.75,10.77 22.76,10.77 23.06,10.47 23.06,10.01 24.03,10.01 v1(24.08,10.06) ; 20.51,5.1 20.51,2.85
  Top Layer w0.254: L2.1 15.49,6.4 C5.1 ; v1(28.5,17.12) 28.84,17.12 C28.2
  Top Layer w0.508: v1(27.23,6.51) 27.23,6.28 26.94,5.99 ; K1.1 40.2,1.88 v1(38.51,1.88) ; LDO1.5 30.01,4.7 ; R7.1 27.74,11.39 26.37,10.01 v1(25.5,10.01) 25.76,9.75 C6.1 25.3,8.67 25.3,7.74 C29.2 ; 33.14,20.07 35.8,20.07 37.08,21.35 41.78,21.35 42.25,20.88 42.25,20.02 ; C26.2 30.89,4.47 31.19,4.78 v1(31.19,4.93) ; 42.16,1.94 42.8,1.3 43.94,1.3 ; 42.16,1.94 40.28,1.94 ; 42.16,1.94 42.17,1.94 42.22,2 ; C5.1 16.6,5.28 C15.2 ; 29.85,4.54 29.8,4.49
  Top Layer w0.635: v1(17.58,4.17) 17.37,3.97 C15.2 ; 26.94,5.99 26.93,5.98 C7.1 25.2,6.45 25.2,7.57 C29.2 ; C3.2 20.33,0.91 C4.2 20.33,2.84 ; K2.1 33.14,19.53 v1(32.72,19.1)
  Bottom Layer w0.254: v1(24.28,18.29) 24.28,19.71 25.75,21.18 32.06,21.18 32.92,20.32 32.92,19.31 v1(32.72,19.1) ; v1(28.5,17.12) 30.02,18.64 32.25,18.64
  Bottom Layer w0.508: 32.77,1.88 31.19,3.46 v1(31.19,4.93) v1(31.19,5.48) 28.25,5.48 v1(27.23,6.51) ; v1(38.51,1.88) 33.79,1.88
  Bottom Layer w0.635: v1(32.72,19.1) 31.34,17.73 31.34,5.63 v1(31.19,5.48) ; 33.79,1.88 21.28,1.88 v1(20.32,2.85) ; v1(17.58,4.17) 16.76,4.98 16.76,7.62 18.85,9.71 23.73,9.71 v1(24.08,10.06) 25.45,10.06 v1(25.5,10.01)
32K_N: length 8.2
  Top Layer w0.16: 26.15,1.65 25.82,1.65 24.42,3.05 22.09,3.05 21.52,3.62 21.52,5.03 ; 27.38,2.1 26.12,2.1 26.04,2.01
32K_P: length 5.2
  Top Layer w0.16: 21.86,2.02 23.15,2.02 23.64,1.52 ; 21.01,5.07 21.02,2.94 21.78,2.18
BAT+: length 14.2
  Top Layer w0.635: 6.07,16.11 C22.2 3.61,17.86 BAT1.1 ; U3.3 11.13,16.36 L3.1 8.85,16.94 8.03,16.11 C21.2
D1: length 12.3
  Top Layer w0.16: v1(23.86,4.54) 23.56,4.54 23.24,4.53 23.15,4.61 23.15,4.61 23.03,4.74 ; 23.03,4.73 23.03,4.74 ; 23.03,4.74 23.03,4.98 23,5.01
  Top Layer w0.203: v1(29.01,12.55) 29.18,12.72 Q2.2
  Bottom Layer w0.203: v1(23.86,4.54) 29.01,9.69 v1(29.01,12.55)
D6: length 14.1
  Top Layer w0.203: Q1.2 28.41,2.83 v1(28.09,3.15) ; 17.98,7.78 18.04,7.83 18.78,7.83
  Bottom Layer w0.203: v1(18.01,7.8) 18.06,7.8 22.71,3.15 v1(28.09,3.15)
D7: length 9.7
  Top Layer w0.203: 18.78,8.33 16.7,8.33 v1(16.56,8.47) ; v1(20.01,13.57) 19.61,13.16 R20.1
  Bottom Layer w0.203: v1(20.01,13.57) 20.01,11.92 v1(16.56,8.47)
D+: length 4.4
  Top Layer w0.127: R4.2 7.52,7.11 6.64,7.99 USB1.8 5.36,7.99 5.12,8.23 5.12,8.79 5.33,8.99 USB1.6
D-: length 3.5
  Top Layer w0.127: R5.2 6.93,8.2 6.66,8.47 ; 6.66,8.47 6.85,8.65 6.85,9.29 6.66,9.47 6.02,9.47 5.98,9.51 ; 6.66,8.47 6.64,8.49 USB1.7
S1: length 5.2
  Top Layer w0.508: 40.24,9.58 41.6,9.58 44.3,12.28
S2: length 4.7
  Top Layer w0.508: 40.49,12.54 42.14,12.54 44.32,14.72
$1N506: length 2.7
  Top Layer w0.16: 9.8,2.28 arc(9.75,2.27) 9.71,2.24
  Top Layer w0.5: A1.1 10.93,2.37 C1.1 12.33,2.29 L1.1
$1N541: length 7.8
  Top Layer w0.3: 14.75,2.28 17.07,2.28 arc(17.98,2.46) 18.75,2.98 18.78,3 arc(19.24,3.63) 19.49,4.38 19.51,4.4 U1.1
  Top Layer w0.5: C2.1 14.74,2.29 L1.2
$1N1807: length 11
  Top Layer w0.16: 12.4,3.98 12.4,5.15 12.18,5.37 ; 12.05,5.49 12.18,5.37 ; 12.18,5.37 12.82,4.75 14.19,4.75 14.56,5.12 14.56,7.09 14.86,7.4 17.04,7.4 ; 17.04,7.4 17.62,6.82 18.77,6.82
$1N1815: length 8.2
  Top Layer w0.16: 13.71,7.79 13.3,8.19 C9.1 ; 13.71,7.79 16.88,7.79 16.88,7.79 17.21,7.79 17.73,7.27 18.72,7.27 18.78,7.33 ; 13.71,7.79 13.59,7.67 13.59,7.48 ; 13.59,7.48 X1.3 13.59,6.75 13.59,7.48
$1N6331: length 11.3
  Top Layer w0.127: 8.39,6.78 9.05,6.78 11.21,8.94 18.22,8.94 18.33,8.83 18.78,8.83
$1N6375: length 11
  Top Layer w0.127: 8.39,7.95 9.83,7.95 11.09,9.22 18.22,9.22 18.33,9.33 18.78,9.33
$1N6429: length 17.1
  Top Layer w0.16: v1(22.92,4.06) 22.54,4.45 22.54,5.08
  Top Layer w0.203: C14.2 R7.2 26.92,13.09 25.53,11.7 ; 25.53,11.7 v1(25.53,12.6) ; 25.53,11.7 S2.2
  Bottom Layer w0.203: v1(22.92,4.06) 22.92,5.3 26.77,9.15 26.77,11.36 v1(25.53,12.6)
$1N6490: length 7.1
  Top Layer w0.203: 20.5,11.78 20.6,11.68 S1.1 23.53,11.68 24.64,10.57 24.64,9.17 24.3,8.83 23.73,8.83
$1N9298: length 7.6
  Top Layer w0.16: 26.64,3.49 26.95,3.8 26.95,5.06 ; 27,5.06 27,5.09 ; 22.04,5.05 22.04,5 ; 21.98,5 21.98,4.17 22.64,3.5 26.62,3.5 ; 22,5.08 22.03,5.05
$1N9448: length 3.9
  Top Layer w0.16: 17.43,6.36 17.18,6.62 16.59,6.62 ; 17.43,6.36 18.74,6.36 18.78,6.33 ; 17.43,6.36 17.96,5.84 ; 18.82,5.84 17.95,5.84
$1N12514: length 1.8
  Top Layer w0.127: R9.1 6.96,10.01 5.98,10.01
$1N12518: length 2.2
  Top Layer w0.127: R10.1 7.52,5.91 6.9,6.53 6.9,6.76 6.65,7.01 5.98,7.01
$1N12731: length 2.5
  Top Layer w0.508: R11.2 14.15,19.75 U3.1
$1N13266: length 6.4
  Top Layer w0.381: U3.8 19.07,20.23 R16.1 18.35,20.26 R14.1 16.86,20.26 R13.2
$1N13419: length 7.1
  Top Layer w0.635: L3.2 12.32,11.33 13.21,12.22 13.21,14.13 14.16,15.09 U3.4
$1N13736: length 3.5
  Top Layer w0.203: R17.1 22.51,17.48 22.75,17.24 22.75,17.06 22.96,16.85 23.14,16.85 R18.1
  Top Layer w0.381: R17.1 22,17.63 U3.7
$1N13763: length 2.6
  Top Layer w0.203: D3.2 22.51,18.44 22.66,18.3 23.24,18.3 23.38,18.16 23.38,17.5 23.38,17.49
$1N14938: length 11.1
  Top Layer w0.508: 33,1.94 34.23,3.18 ; 31.53,1.89 32.99,1.89 ; 34.29,3.28 42.16,3.28 42.16,3.28
$1N15274: length 17.8
  Top Layer w0.508: Q2.3 31.47,14.6 31.04,15.04 31.04,17.33 31.75,18.04 35.31,18.04 37.36,20.09 40.31,20.09 ; 40.4,19.92 41.57,18.74 42.33,18.74
$1N15885: length 11.9
  Top Layer w0.203: D4.1 25.3,19.91 25.3,19.57 25.25,19.52 25.25,18.51 25.3,18.46 v1(25.3,15.86) ; v1(20.88,13.67) 20.88,13.23 R20.2
  Bottom Layer w0.203: v1(20.88,13.67) 23.06,13.67 25.26,15.86 v1(25.3,15.86)

## Copper pours and planes (outline as drawn; the poured copper is in the pictures)
AGND on Top Layer: 32.1,17.53 48.77,17.53 48.77,4.35 32.1,4.35
AGND on Bottom Layer: 32.1,17.51 48.77,17.51 48.77,4.34 32.1,4.34
GND on Top Layer: -1.83,23.32 49.83,23.32 49.83,-1.16 -1.83,-1.16
GND on Bottom Layer: -3.4,23.32 51.31,23.32 51.31,-1.37 -3.4,-1.37
VBUS on Top Layer: 2.95,11.43 6.55,11.43 6.55,6.05 2.95,6.05

## Text on the board
Bottom Silkscreen Layer: BAT- | BAT+ | 6V/NC | GND | S2 | S1 | EPS32-C3 Camera Trigger V1.0 / 2025-08-23
Top Silkscreen Layer: BOOT EN | -
